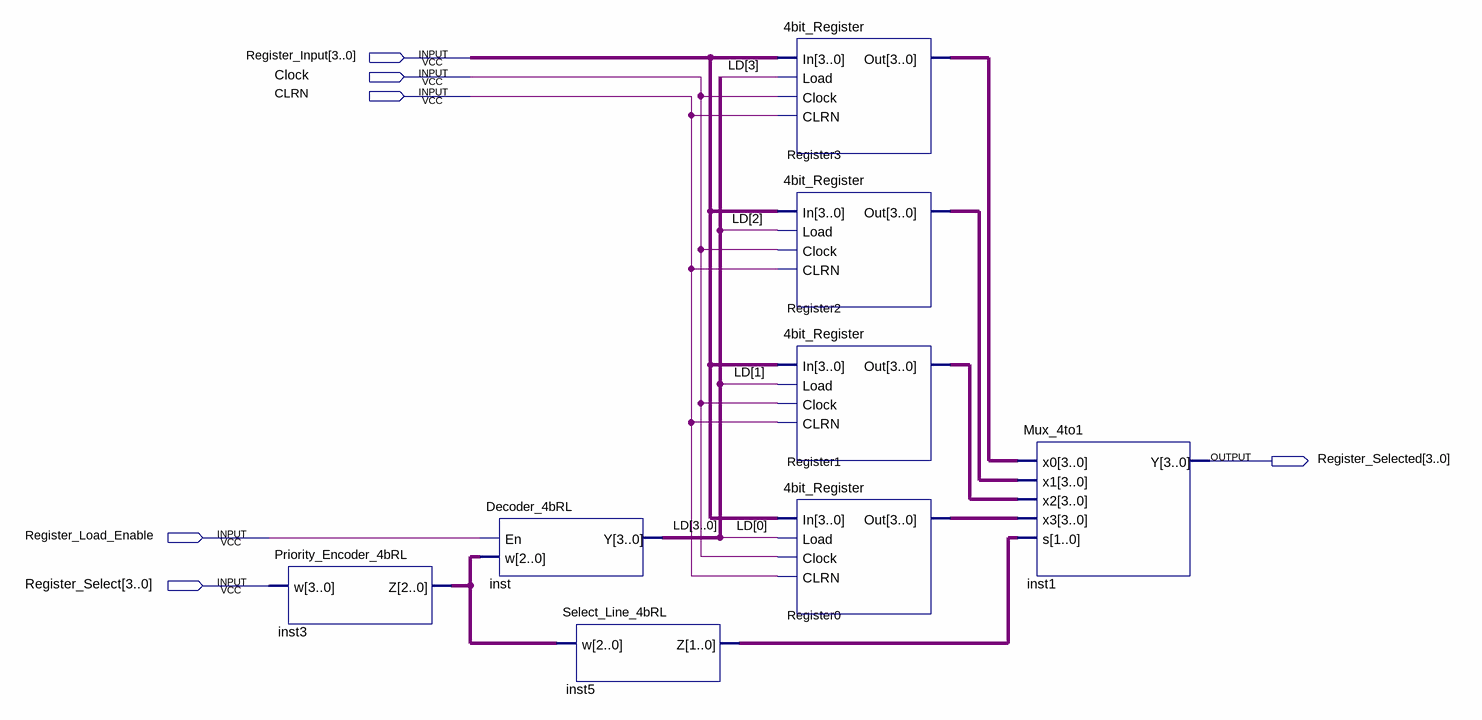
[diagram p0: schematic sheet]
// Quartus schematic 4_4bit_Register_File.bdf as structural Verilog: 8 symbols, 6 pins
module \4_4bit_Register_File  (
  input  [3:0] Register_Input,
  input  Clock,
  input  CLRN,
  input  Register_Load_Enable,
  input  [3:0] Register_Select,
  output [3:0] Register_Selected
);

  wire [1:0] inst5_z;
  wire [2:0] inst3_z;
  wire [3:0] LD, Register0_out, Register1_out, Register2_out, Register3_out;

  Priority_Encoder_4bRL inst3 (.w(Register_Select), .Z(inst3_z));
  Decoder_4bRL inst (.En(Register_Load_Enable), .w(inst3_z), .Y(LD));
  Select_Line_4bRL inst5 (.w(inst3_z), .Z(inst5_z));
  \4bit_Register  Register3 (.In(Register_Input), .Load(LD[3]), .Clock(Clock), .CLRN(CLRN), .Out(Register3_out));
  \4bit_Register  Register2 (.In(Register_Input), .Load(LD[2]), .Clock(Clock), .CLRN(CLRN), .Out(Register2_out));
  \4bit_Register  Register1 (.In(Register_Input), .Load(LD[1]), .Clock(Clock), .CLRN(CLRN), .Out(Register1_out));
  \4bit_Register  Register0 (.In(Register_Input), .Load(LD[0]), .Clock(Clock), .CLRN(CLRN), .Out(Register0_out));
  Mux_4to1 inst1 (
    .x0(Register3_out), .x1(Register2_out), .x2(Register1_out), .x3(Register0_out), .s(inst5_z),
    .Y(Register_Selected));
endmodule
